# Altium schematic sheet SimonSays.SchDoc
size 209 x 148 mm; DocumentNumber: 1; SheetNumber: 1; SheetTotal: 1
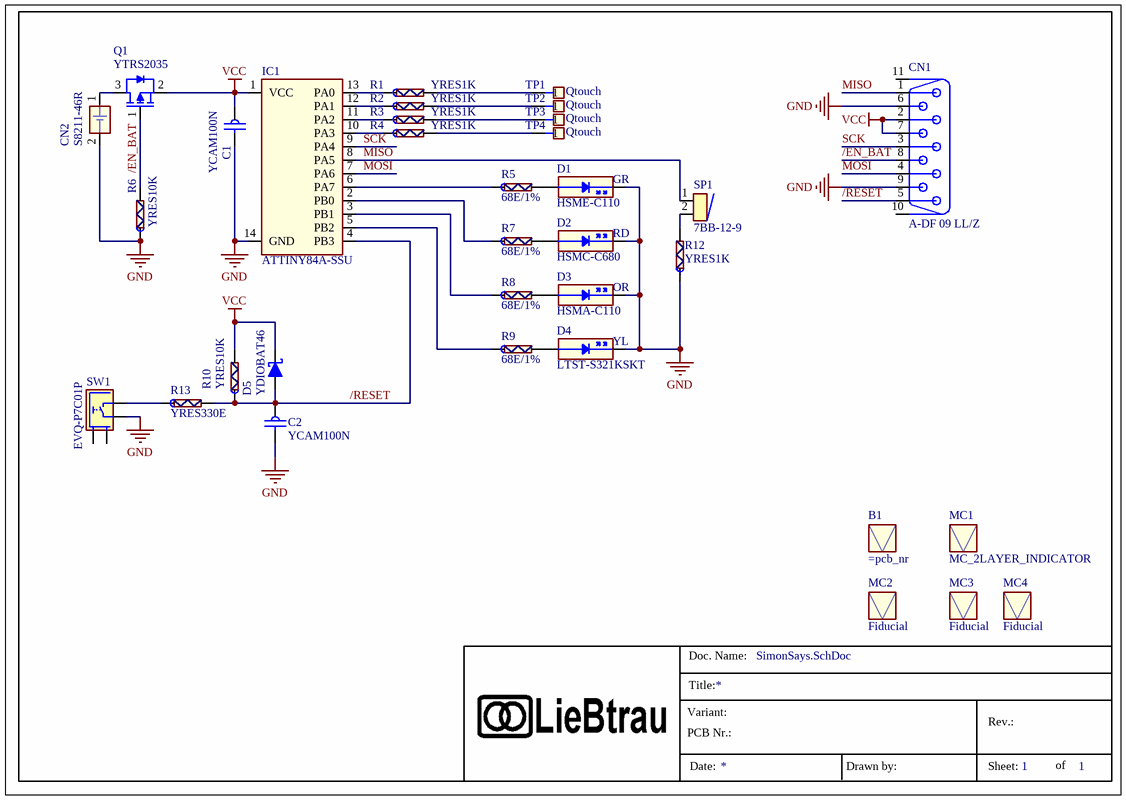
[diagram p0: SimonSays.SchDoc]

## Parts
B1  (no value)  [MC_BoardNr]
C1  YCAM100N  [CA_STD1206_H16]
C2  YCAM100N  [CA_STD1206_H16]
CN1  A-DF 09 LL/Z  [CN_SUBD_9P_FEMALE_EDGE]
CN2  S8211-46R  [CN_BAT_CLIP_HARWIN_S8211-46R]
D1  HSME-C110  [DI_AVAGO_HSMx-C680]
D2  HSMC-C680  [DI_AVAGO_HSMx-C680]
D3  HSMA-C110  [DI_AVAGO_HSMx-C680]
D4  LTST-S321KSKT  [DI_AVAGO_HSMx-C680]
D5  YDIOBAT46  [DI_SOD123]
IC1  ATTINY84A-SSU  [SC_SO14]
MC1  MC_2LAYER_INDICATOR  [MC_2LAYER_INDICATOR]  (no BOM)
MC2  Fiducial  [MC_FIDUCIAL]  (no BOM)
MC3  Fiducial  [MC_FIDUCIAL]  (no BOM)
MC4  Fiducial  [MC_FIDUCIAL]  (no BOM)
Q1  YTRS2035  [SC_SOT23_3P]
R1  YRES1K  [RE_STD1206_H6]
R2  YRES1K  [RE_STD1206_H6]
R3  YRES1K  [RE_STD1206_H6]
R4  YRES1K  [RE_STD1206_H6]
R5  68E/1%  [RE_STD1206_H6]
R6  YRES10K  [RE_STD1206_H6]
R7  68E/1%  [RE_STD1206_H6]
R8  68E/1%  [RE_STD1206_H6]
R9  68E/1%  [RE_STD1206_H6]
R10  YRES10K  [RE_STD1206_H6]
R12  YRES1K  [RE_STD1206_H6]
R13  YRES330E  [RE_STD1206_H6]
SP1  7BB-12-9  [LS_MURATA_7BB-12-9]
SW1  EVQ-P7C01P  [CN_PANASONIC_EVQ-P7]
TP1  Qtouch  [SW_ATMEL_QTOUCH_BUTTON]  (no BOM)
TP2  Qtouch  [SW_ATMEL_QTOUCH_BUTTON]  (no BOM)
TP3  Qtouch  [SW_ATMEL_QTOUCH_BUTTON]  (no BOM)
TP4  Qtouch  [SW_ATMEL_QTOUCH_BUTTON]  (no BOM)

## Nets
GND: C1.2 C2.2 CN1.6 CN1.9 CN2.2 D1.C D2.C D3.C D4.C IC1.14(GND) R6.1 R12.1 SW1.2
VCC: C1.1 CN1.2 CN1.7 D5.C IC1.1(VCC) Q1.2(S) R10.2
/EN_BAT: CN1.8 Q1.1(G) R6.2
/RESET: C2.1 CN1.5 D5.A IC1.4(PB3) R10.1 R13.2
MISO: CN1.1 IC1.8(PA5) SP1.1
MOSI: CN1.4 IC1.7(PA6)
SCK: CN1.3 IC1.9(PA4)
NetCN2_1: CN2.1 Q1.3(D)
NetD1_A: D1.A R5.2
NetD2_A: D2.A R7.2
NetD3_A: D3.A R8.2
NetD4_A: D4.A R9.2
NetIC1_2: IC1.2(PB0) R7.1
NetIC1_3: IC1.3(PB1) R8.1
NetIC1_5: IC1.5(PB2) R9.1
NetIC1_6: IC1.6(PA7) R5.1
NetIC1_10: IC1.10(PA3) R4.1
NetIC1_11: IC1.11(PA2) R3.1
NetIC1_12: IC1.12(PA1) R2.1
NetIC1_13: IC1.13(PA0) R1.1
NetR1_2: R1.2 TP1.1
NetR2_2: R2.2 TP2.1
NetR3_2: R3.2 TP3.1
NetR4_2: R4.2 TP4.1
NetR12_2: R12.2 SP1.2
NetR13_1: R13.1 SW1.1

Not connected (* = marked no-connect by the designer): CN1 10 11; SW1 SH1 SH2

## Notes on the sheet
- (near D1) GR
- (near D2) RD
- (near CN1) Program + Debug:
  Pin 1-6: connect 1-1 to Atmel ISP-programmer
  Pin 7-8: connect to +5 during programming
  Pin 9: extra GND for powering during programming.
  Connector can be sled on the PCB edge for programming and debug and be removed afterwards.
- (near D4) YL
- (near D3) OR
- LEDs must be driven push-pull on MCU, not open drain.  In case of open drain driving, extra decoupling capacitors would be needed.
- (near SW1) Push button to reset device and so make it wake up from eternal sleep.
- (near C2) Only the series resistor and the switch are absolutely needed.  Other components are an EMC precaution.
- Title:
- Doc. Name:
- Variant:
- PCB Nr.:
- Rev.:
- Date:
- Drawn by:
- Sheet:
- of

## Library data of the parts
B1 = pcb_nr: Article: pcb_nr; Status: A; Order Code: =PCB_Nr
C1 C2 = YCAM100N: 100N; Sub Category: Ceramic; Order Code: Farnell 1759361; Article: YCAM100N; Category: Capacitor; Status: A
CN1 = A-DF 09 LL/Z: Edge mount Connector; Sub Category: DSUB; Order Code: RS 674-0735; Article: A-DF 09 LL/Z; Category: Connector; Status: A
CN2 = S8211-46R: Coin cell holder CR2032; Sub Category: Other; Order Code: RS 219-7954 / Farnell 2115303 / Farnell 1650693; Article: S8211-46R; Category: Connector; Status: A
D1 = HSME-C110: GREEN; Sub Category: Led; Order Code: RS 692-1247 / Farnell 2146441 / Farnell 1652086; Article: HSME-C110; Category: Diode; Status: A
D2 = HSMC-C680: RED; Sub Category: Led; Order Code: RS 692-1256 / Farnell 1652085 / Farnell 8554498 / Farnell 2146439; Article: HSMC-C680; Category: Diode; Status: A
D3 = HSMA-C110: AMBER; Sub Category: Led; Order Code: Farnell 1652082 / RS 813-4906 / Farnell 8554455 / Farnell 2146440; Article: HSMA-C110; Category: Diode; Status: A
D4 = LTST-S321KSKT: YELLOW; Sub Category: Led; Order Code: RS 692-1259 / Farnell 2146442 / Farnell 2335806; Article: LTST-S321KSKT; Category: Diode; Status: A
D5 = YDIOBAT46: BAT46; Sub Category: Schottky; Order Code: Farnell 2069340; Article: YDIOBAT46; Category: Diode; Status: P
IC1 = ATTINY84A-SSU: Sub Category: Programmable; Order Code: RS 738-0687 / Farnell 1972173; Article: ATTINY84A-SSU; Category: IC; Status: A
Q1 = YTRS2035: DMP2035; Sub Category: MOSFET P; Order Code: Farnell 2061419; Article: YTRS2035; Category: Transistor; Status: P
R1-R4 R12 = YRES1K: 1K; Sub Category: Generic; Order Code: Farnell 1469965; Article: YRES1K; Category: Resistor; Status: A
R5 R7-R9 = 68E/1%: 68E; Sub Category: Generic; Order Code: Farnell 1400426; Article: 68E/1%; Category: Resistor; Status: A
R6 R10 = YRES10K: 10K; Sub Category: Generic; Order Code: Farnell 1469970; Article: YRES10K; Category: Resistor; Status: A
R13 = YRES330E: 330E; Sub Category: Generic; Order Code: Farnell 1100177; Article: YRES330E; Category: Resistor; Status: A
SP1 = 7BB-12-9: 12mm piezo; Order Code: RS 721-4947 / Farnell 2433032; Article: 7BB-12-9; Category: Speaker; Sub Category: Piezo; Status: A
SW1 = EVQ-P7C01P: Sub Category: SPST NO; Order Code: RS 811-3353 / Farnell 2459549; Article: EVQ-P7C01P; Category: Switch; Status: A
TP1-TP4 = QtouchButton: Sub Category: Capacitive; Article: QtouchButton; Category: Switch; Status: A
MC1 = MC_2LAYER_INDICATOR: Article: MC_2LAYER_INDICATOR; Status: A
MC2-MC4 = Fiducial: Article: Fiducial; Status: A